# Altium schematic sheet pixracer_imu.SchDoc
size A4; SheetNumber: 2; SheetTotal: 5
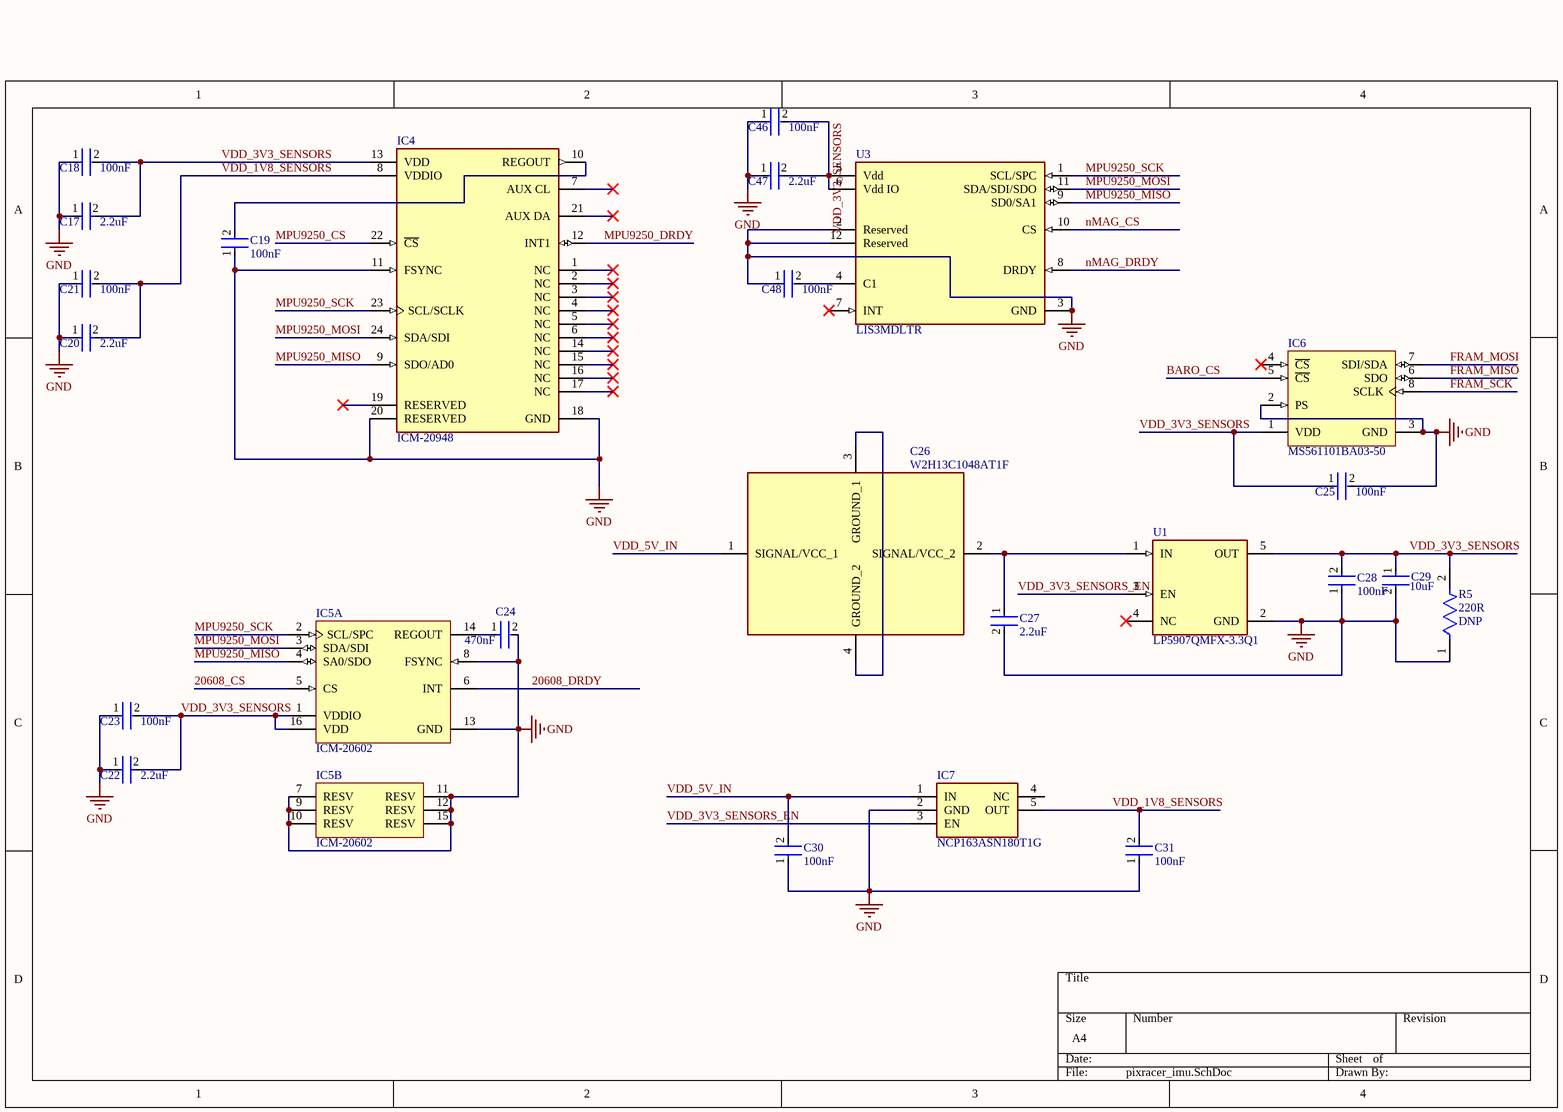
[diagram p0: pixracer_imu.SchDoc]

## Parts
C17  Capacitance: 2.2uF  [FP-C1608-080-0_1-MFG]  (hidden comment: C1608X7R1A225K080AC)
C18  Capacitance: 100nF  [FP-0603-L_1_6_0_15-W_0_81-IPC_B]  (hidden comment: 0603ZC104MAT2A)
C19  Capacitance: 100nF  [FP-0603-L_1_6_0_15-W_0_81-IPC_B]  (hidden comment: 0603ZC104MAT2A)
C20  Capacitance: 2.2uF  [FP-C1608-080-0_1-MFG]  (hidden comment: C1608X7R1A225K080AC)
C21  Capacitance: 100nF  [FP-0603-L_1_6_0_15-W_0_81-IPC_B]  (hidden comment: 0603ZC104MAT2A)
C22  Capacitance: 2.2uF  [FP-C1608-080-0_1-MFG]  (hidden comment: C1608X7R1A225K080AC)
C23  Capacitance: 100nF  [FP-0603-L_1_6_0_15-W_0_81-IPC_B]  (hidden comment: 0603ZC104MAT2A)
C24  Capacitance: 470nF  [FP-CL10-IPC_B]  (hidden comment: CL10B474KP8NNNC)
C25  Capacitance: 100nF  [FP-0603-L_1_6_0_15-W_0_81-IPC_B]  (hidden comment: 0603ZC104MAT2A)
C26  W2H13C1048AT1F  [W2H13C1048AT1A]
C27  Capacitance: 2.2uF  [FP-C1608-080-0_1-MFG]  (hidden comment: C1608X7R1A225K080AC)
C28  Capacitance: 100nF  [FP-0603-L_1_6_0_15-W_0_81-IPC_B]  (hidden comment: 0603ZC104MAT2A)
C29  Capacitance: 10uF  [FP-CL10-IPC_B]  (hidden comment: CL10A106KP8NNND)
C30  Capacitance: 100nF  [FP-0603-L_1_6_0_15-W_0_81-IPC_B]  (hidden comment: 0603ZC104MAT2A)
C31  Capacitance: 100nF  [FP-0603-L_1_6_0_15-W_0_81-IPC_B]  (hidden comment: 0603ZC104MAT2A)
C46  Capacitance: 100nF  [FP-0603-L_1_6_0_15-W_0_81-IPC_B]  (hidden comment: 0603ZC104MAT2A)
C47  Capacitance: 2.2uF  [FP-C1608-080-0_1-MFG]  (hidden comment: C1608X7R1A225K080AC)
C48  Capacitance: 100nF  [FP-0603-L_1_6_0_15-W_0_81-IPC_B]  (hidden comment: 0603ZC104MAT2A)
IC4  ICM-20948  [FP-ICM-20948-IPC_C]
IC5  ICM-20602  [INSE-I62-16]  (parts A,B of 2)
IC6  MS561101BA03-50  [MSI-MS561101BA03-50-8_V]
IC7  NCP163ASN180T1G  [SOT95P280X145-5N]
R5  DNP  Resistance: 220R  [FP-CRCW0603-e3-MFG]
U1  LP5907QMFX-3.3Q1  [FP-DBV0005A-MFG]
U3  LIS3MDLTR  [FP-VFLGA-12-8365767-MFG]

## Nets
GND: C17.1 C18.1 C19.1 C20.1 C21.1 C22.1 C23.1 C24.2 C25.2 C27.2 C28.1 C29.2 C30.1 C31.1 C46.1 C47.1 C48.1 IC4.11(FSYNC) IC4.18(GND) IC4.20(RESERVED) IC5.7(RESV) IC5.8(FSYNC) IC5.9(RESV) IC5.10(RESV) IC5.11(RESV) IC5.12(RESV) IC5.13(GND) IC5.15(RESV) IC6.2(PS) IC6.3(GND) IC7.2(GND) R5.1 U1.2(GND) U3.2(Reserved) U3.3(GND) U3.12(Reserved)
20608_CS: IC5.5(CS)
20608_DRDY: IC5.6(INT)
BARO_CS: IC6.5(~{CS})
FRAM_MISO: IC6.6(SDO)
FRAM_MOSI: IC6.7(SDI/SDA)
FRAM_SCK: IC6.8(SCLK)
MPU9250_CS: IC4.22(~{CS})
MPU9250_DRDY: IC4.12(INT1)
MPU9250_MISO: IC4.9(SDO/AD0) IC5.4(SA0/SDO) U3.9(SD0/SA1)
MPU9250_MOSI: IC4.24(SDA/SDI) IC5.3(SDA/SDI) U3.11(SDA/SDI/SDO)
MPU9250_SCK: IC4.23(SCL/SCLK) IC5.2(SCL/SPC) U3.1(SCL/SPC)
nMAG_CS: U3.10(CS)
nMAG_DRDY: U3.8(DRDY)
VDD_1V8_SENSORS: C20.2 C21.2 C31.2 IC4.8(VDDIO) IC7.5(OUT)
VDD_3V3_SENSORS: C17.2 C18.2 C22.2 C23.2 C25.1 C28.2 C29.1 C46.2 C47.2 IC4.13(VDD) IC5.1(VDDIO) IC5.16(VDD) IC6.1(VDD) R5.2 U1.5(OUT) U3.5(Vdd) U3.6(Vdd_IO)
VDD_3V3_SENSORS_EN: IC7.3(EN) U1.3(EN)
VDD_5V_IN: C26.1(SIGNAL/VCC_1) C30.2 IC7.1(IN)
NetC19_2: C19.2 IC4.10(REGOUT)
NetC24_1: C24.1 IC5.14(REGOUT)
NetC26_2: C26.2(SIGNAL/VCC_2) C27.1 U1.1(IN)
NetC26_3: C26.3(GROUND_1) C26.4(GROUND_2)
NetC48_2: C48.2 U3.4(C1)

Not connected (* = marked no-connect by the designer): IC4 1(NC)* 2(NC)* 3(NC)* 4(NC)* 5(NC)* 6(NC)* 7(AUX_CL)* 14(NC)* 15(NC)* 16(NC)* 17(NC)* 19(RESERVED)* 21(AUX_DA)*; IC6 4(~{CS})*; IC7 4(NC); U1 4(NC)*; U3 7(INT)*

## Library data of the parts
C17 C20 C22 C27 C47 = CMP-08246-006835-1: Multilayer Ceramic Capacitors 2.2μF ±10% 10V X7R SMD 0603; Lead Free: Lead Free; Mount: Surface Mount; Case Code (Metric): 1608; Construction: Flat; Packaging: Tape and Reel; REACH SVHC: No SVHC; Weight: 7.1E-05oz; Resistor Type: Ceramic; Package Quantity: 4000; Voltage Rating (DC): 10V; Case/Package: 0603; Termination: SMD/SMT; Case Code (Imperial): 0603; Series: C; Voltage Rating: 10V; Min Operating Temperature: -55°C; Dielectric Material: Ceramic; Length: 1.6mm; Tolerance: 10%; Depth: 0.8mm; Width: 0.031inch; Dielectric: X7R; Max Operating Temperature: 125°C; RoHS Compliant: Yes; Height: 0.8mm; Thickness: 0.037inch
C18 C19 C21 C23 C25 C28 C30 C31 C46 C48 = CMP-2006-04550-2: General Purpose Ceramic Capacitor, 0603, 100nF, 20%, X7R, 15%, 10V; Mount: Surface Mount; Package Quantity: 4000; RoHS Compliant: Yes; Case Code (Imperial): 0603; Voltage Rating: 10V; Packaging: Tape and Reel; Series: -; Tolerance: 20%; Thickness: 0.035inch; Number of Pins: 2; Min Operating Temperature: -55°C; Case/Package: 0603; Length: 1.6mm; Radiation Hardening: No; Voltage Rating (DC): 10V; Depth: 0.81mm; Lead Pitch: 0.014inch; Termination: SMD/SMT; Case Code (Metric): 1608; Construction: Flat; Width: 0.032inch; Lead Free: Lead Free; Max Operating Temperature: 125°C; Dielectric: X7R
C24 = CMP-13271-000054-1: Cap Ceramic 470nF 10V X7R ±10% Pad SMD 0603 +125°C T/R; Case Code (Imperial): 0603; Mount: Surface Mount; Width: 0.031inch; Voltage Rating: 10V; Package Quantity: 1; Radiation Hardening: No; Thickness: 0.035inch; Case Code (Metric): 1608; Voltage: 10V; Packaging: Tape and Reel; Length: 1.6mm; Dielectric: X7R; Lead Free: Lead Free; Depth: 0.8mm; Max Operating Temperature: 125°C; Tolerance: 10%; Voltage Rating (DC): 10V; Min Operating Temperature: -55°C; Case/Package: 0603; Height: 0.8mm
C26 = W2H13C1048AT1F: Capacitor; Manufacturer_Name: AVX; Datasheet Link: https://componentsearchengine.com/Datasheets/1/W2H13C1048AT1F.pdf; Height: 1mm; Manufacturer_Part_Number: W2H13C1048AT1F; Mouser Part Number: 581-W2H13C1048AT1F; Mouser Price/Stock: https://www.mouser.com/Search/Refine.aspx?Keyword=581-W2H13C1048AT1F; Arrow Part Number: W2H13C1048AT1F; Arrow Price/Stock: https://www.arrow.com/en/products/w2h13c1048at1f/avx
C29 = CMP-13271-003245-1: Cap Ceramic 10uF 10V X5R ±10% Pad SMD 0603 +85°C T/R; Packaging: Tape and Reel; Dielectric: X5R; Min Operating Temperature: -55°C; Lead Free: Lead Free; Height: 0.8mm; Package Quantity: 10000; Voltage Rating (DC): 10V; Mount: Surface Mount; Tolerance: 10%; Width: 0.031inch; Thickness: 0.035inch; Depth: 0.8mm; Max Operating Temperature: 85°C; Case/Package: 0603; Length: 1.6mm; Voltage Rating: 10V; Radiation Hardening: No
IC4 = CMP-221217-000001-1: IMU ACCEL/GYRO/COMPI2C/SPI 24QFN
IC5 = CMP-2000-07589-1: High Performance 6-Axis MEMS MotionTracking(TM) Device, 1.71 to 3.45 V, -40 to 85 degC, 16-Pin LGA, RoHS; Manufacturer: InvenSense; Sensor Type: Temperature; Output Type: I2C; RoHSCompliant: True; Datasheet Version: Rev. 1.0, 10/2016; Datasheet URL: http://www.invensense.com/wp-content/uploads/2016/10/DS-000176-ICM-20602-v1.0.pdf; Min Operating Temperature: -40degC; Mounting Technology: SurfaceMount; Max Operating Temperature: 85degC; Manufacturer URL: http://www.invensense.com/; Package Reference: I62-16; Package Description: 16-Pin Land Grid Array, Body 3 x 3 mm, Pitch 0.5 mm
IC6 = CMP-2000-05251-1: Barometric Pressure Sensor, with Stainless Steel Cap, 1.8 to 3.6 V, -45 to 85 degC, 8-Pin QFN, RoHS, Tape and Reel; Manufacturer: Measurement Specialties; Operating Pressure Max: 1200mbar; Supply Current: 12.5µA; Supply Voltage Max: 3.6V; Supply Voltage Min: 1.8V; No. of Pins: 8; Connection Size: 0.5mm; SVHC: NoSVHC(20-Jun-2013); Operating Pressure Min: 10mbar; Manufacturer URL: http://www.meas-spec.com/; Operating Temperature Min: -40degC; Pressure Type: Barometric; Package Reference: MS561101BA03-50-8; Datasheet URL: http://www.te.com/commerce/DocumentDelivery/DDEController?Action=srchrtrv&DocNm=MS5611-01BA03&DocType=Data+Sheet&DocLang=English&DocFormat=pdf&PartCntxt=CAT-BLPS0036; Package Description: 8-Pin Surface Mount Device, Body 5 x 3 mm, Pitch 1.25 mm; Sensor Case Style: QFN; Datasheet Version: Sep-15; Operating Temperature Max: 85degC
IC7 = NCP163ASN180T1G: Integrated Circuit; Manufacturer_Name: onsemi; Datasheet Link: https://componentsearchengine.com/Datasheets/1/NCP163ASN180T1G.pdf; Height: 1.45mm; Manufacturer_Part_Number: NCP163ASN180T1G; Mouser Part Number: 863-NCP163ASN180T1G; Mouser Price/Stock: https://www.mouser.co.uk/ProductDetail/onsemi/NCP163ASN180T1G?qs=vLWxofP3U2z0o2tJM%252BNAYw%3D%3D; Arrow Part Number: NCP163ASN180T1G; Arrow Price/Stock: https://www.arrow.com/en/products/ncp163asn180t1g/on-semiconductor
R5 = CMP-02407-003555-1: RES Thick Film, 220Ω, 1%, 0.1W, 100ppm/°C, 0603; Voltage Rating: 75V; Power Rating: 100mW; Length: 1.55mm; Weight: 7.1E-05oz; Package Quantity: 10000; Case/Package: 0603; Composition: Thick Film; Max Operating Temperature: 155°C; Military Standard: Not; Tolerance: 1%; Lead Free: Lead Free; Number of Terminations: 2; Min Operating Temperature: -55°C; Case Code (Imperial): 0603; Max Power Dissipation: 100mW; Features: Automotive AEC-Q200; Packaging: Tape and Reel; Temperature Coefficient: 100ppm/°C; Case Code (Metric): 1608; Termination: SMD/SMT; Depth: 0.85mm; Height: 0.02inch; Width: 0.85mm
U1 = CMP-04917-000018-1: IC REG LINEAR 3.3V 250MA SOT23-5; Manufacturer: Texas Instruments; Number Of Outputs: 1; Dropout Voltage: 120mV; Max Junction Temp: +125°C; Output Type: Fixed; Standoff Height: 0mm; Min Supply Voltage: 2.2V; Max Supply Voltage: 5.5V; Nominal Supply Current: 12-250uA; Automotive Grade: Grade 1; Output Voltage: 3.3V; Height: 1.45mm; Category: IC; Output Current: 250mA; Automotive: Yes; Device Class L3: Voltage Regulators - Linear; Temperature Range Low: -40°C; Device Class L1: Integrated Circuits (ICs); Temperature Range High: +125°C; Octopart: https://octopart.com/lp5907qmfx-3.3q1-texas+instruments-50417899; Lead Free: Yes; Device Class L2: Power Management ICs; Manufacturer Part Number: LP5907QMFX-3.3Q1; Mouser Description: Automotive 250-mA ultra-low-noise low-IQ low-dropout (LDO) linear regulator 5-SOT-23 -40 to 125; ComponentLink2Description: Datasheet; Digikey Description: IC REG LINEAR 3.3V 250MA SOT23-5; Temperature: -40°C to +125°C; Package: DBV0005A; ComponentLink2URL: http://www.ti.com/lit/ds/symlink/lp5907-q1.pdf; RoHS: TRUE
U3 = CMP-2000-07463-2: SENSOR MR I2C/SPI 12LGA; Manufacturer: STMicroelectronics; Sensor Output: I2C,SPI; Operating Supply Current: 40-270uA; Max Supply Voltage: 3.6V; Sensing Method: Magnetic; Min Supply Voltage: 1.71V; ComponentLink2URL: https://www.st.com/resource/en/datasheet/lis3mdl.pdf; Category: IC; Manufacturer Part Number: LIS3MDLTR; Octopart: https://octopart.com/lis3mdltr-stmicroelectronics-29403125; Automotive: No; ComponentLink2Description: Datasheet; RoHS: TRUE; Device Class L3: unset; Device Class L1: Sensors; Temperature: -40°C to +85°C; Height: 1mm; Mouser Description: Board Mount Hall Effect / Magnetic Sensors Ultra Lo-Pwr Hi Perf 3-Axis 1.9-3.6V; Temperature Range High: +85°C; Lead Free: Yes; Device Class L2: Magnetic Sensors; Footprint Url: https://www.st.com/content/ccc/resource/technical/document/technical_note/73/17/9c/16/dd/96/4a/01/CD00134799.pdf/files/CD00134799.pdf/jcr:content/translations/en.CD00134799.pdf; Temperature Range Low: -40°C; Package: VFLGA-12-8365767; Digikey Description: SENSOR MR I2C/SPI 12LGA